# Altium schematic sheet RS-485.SchDoc: RS-485
size A3; Engineer: M.GUENI; Revision: R0; SheetNumber: 05; SheetTotal: 10
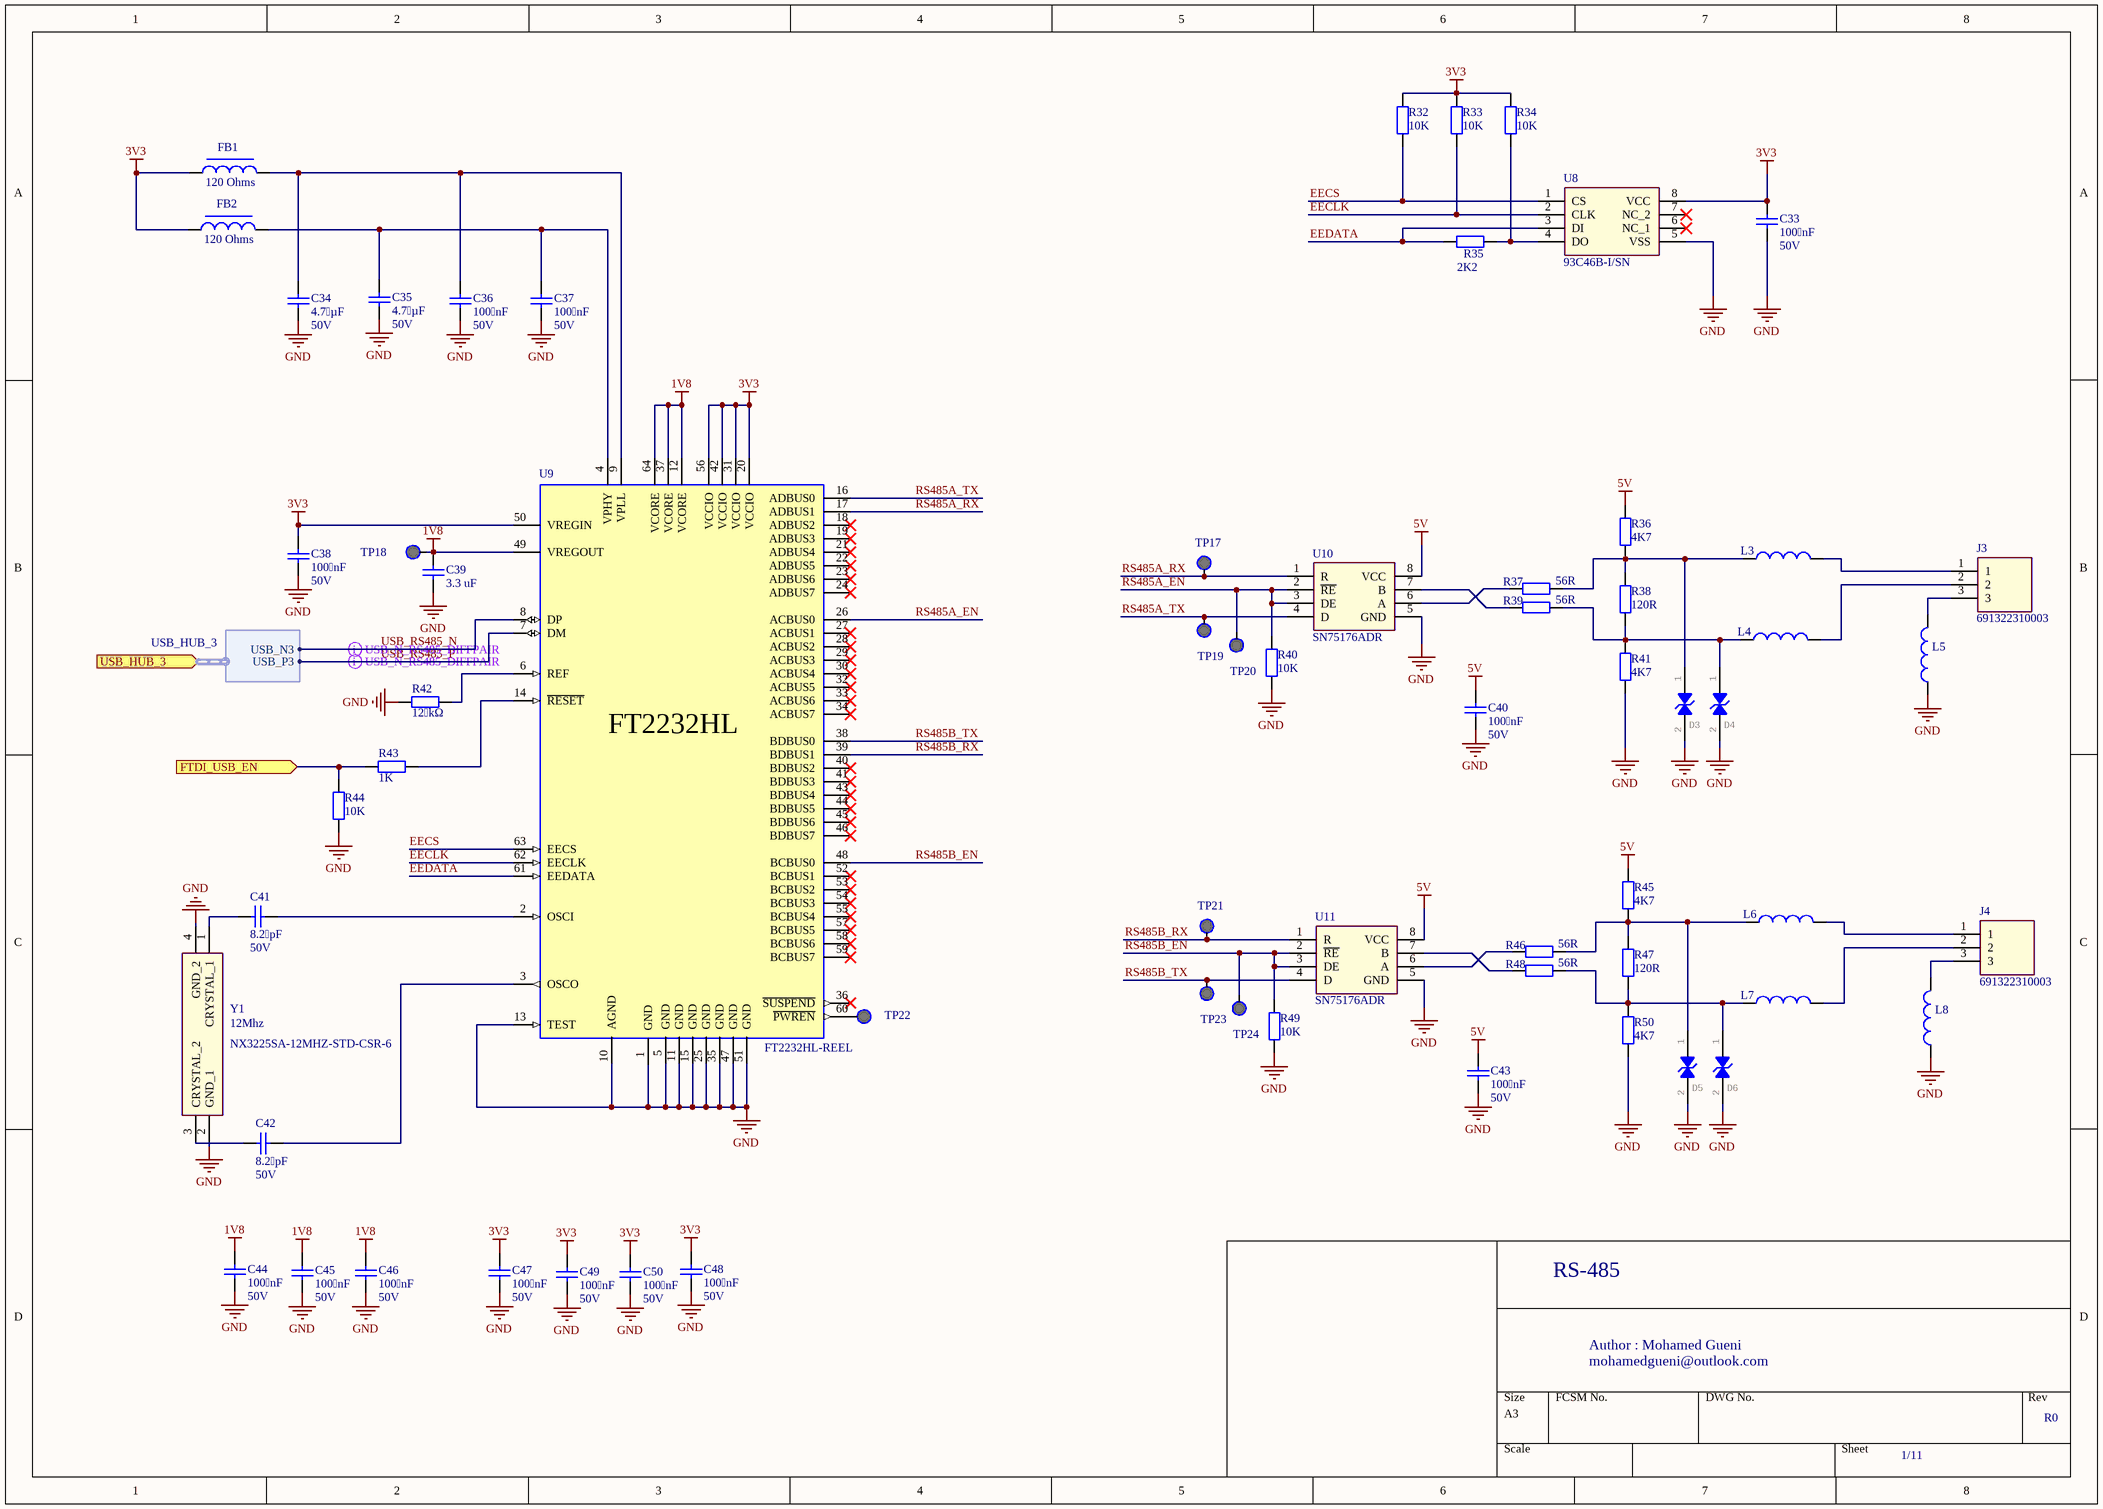
[diagram p0: RS-485.SchDoc]

## Parts
C33  Value 1: 100 nF  Value 2: 50V  [CAPC1608N]  (hidden comment: GRM188R71H104KA93D)
C34  Value 1: 4.7 µF  Value 2: 50V  [CAPC1608N]  (hidden comment: GRM188R61H475KE11D)
C35  Value 1: 4.7 µF  Value 2: 50V  [CAPC1608N]  (hidden comment: GRM188R61H475KE11D)
C36  Value 1: 100 nF  Value 2: 50V  [CAPC1608N]  (hidden comment: GRM188R71H104KA93D)
C37  Value 1: 100 nF  Value 2: 50V  [CAPC1608N]  (hidden comment: GRM188R71H104KA93D)
C38  Value 1: 100 nF  Value 2: 50V  [CAPC1608N]  (hidden comment: GRM188R71H104KA93D)
C39  Value 1: 3.3 uF  [CAPC1608N]
C40  Value 1: 100 nF  Value 2: 50V  [CAPC1608N]  (hidden comment: GRM188R71H104KA93D)
C41  Value 1: 8.2 pF  Value 2: 50V  [CAPC402]  (hidden comment: GRM1555C1H8R2CA01D)
C42  Value 1: 8.2 pF  Value 2: 50V  [CAPC402]  (hidden comment: GRM1555C1H8R2CA01D)
C43  Value 1: 100 nF  Value 2: 50V  [CAPC1608N]  (hidden comment: GRM188R71H104KA93D)
C44  Value 1: 100 nF  Value 2: 50V  [CAPC1608N]  (hidden comment: GRM188R71H104KA93D)
C45  Value 1: 100 nF  Value 2: 50V  [CAPC1608N]  (hidden comment: GRM188R71H104KA93D)
C46  Value 1: 100 nF  Value 2: 50V  [CAPC1608N]  (hidden comment: GRM188R71H104KA93D)
C47  Value 1: 100 nF  Value 2: 50V  [CAPC1608N]  (hidden comment: GRM188R71H104KA93D)
C48  Value 1: 100 nF  Value 2: 50V  [CAPC1608N]  (hidden comment: GRM188R71H104KA93D)
C49  Value 1: 100 nF  Value 2: 50V  [CAPC1608N]  (hidden comment: GRM188R71H104KA93D)
C50  Value 1: 100 nF  Value 2: 50V  [CAPC1608N]  (hidden comment: GRM188R71H104KA93D)
D3  CDSOD323-T12LC  [CDSOD323T12LC]  (value not drawn)
D4  CDSOD323-T12LC  [CDSOD323T12LC]  (value not drawn)
D5  CDSOD323-T12LC  [CDSOD323T12LC]  (value not drawn)
D6  CDSOD323-T12LC  [CDSOD323T12LC]  (value not drawn)
FB1  Value 1: 120 Ohms  [BLM18SP221SN1B]  (hidden comment: BLM18PG121SN1D)
FB2  Value 1: 120 Ohms  [BLM18SP221SN1B]  (hidden comment: BLM18PG121SN1D)
J3  691322310003  [691322310003]
J4  691322310003  [691322310003]
L3  MAF0603FAL330BT000  [BEADC0603X33N]  (value not drawn)
L4  MAF0603FAL330BT000  [BEADC0603X33N]  (value not drawn)
L5  MAF0603FAL330BT000  [BEADC0603X33N]  (value not drawn)
L6  MAF0603FAL330BT000  [BEADC0603X33N]  (value not drawn)
L7  MAF0603FAL330BT000  [BEADC0603X33N]  (value not drawn)
L8  MAF0603FAL330BT000  [BEADC0603X33N]  (value not drawn)
R32  Value 1: 10K  [RESC1608N]  (hidden comment: RN731JTTD1002F25)
R33  Value 1: 10K  [RESC1608N]  (hidden comment: RN731JTTD1002F25)
R34  Value 1: 10K  [RESC1608N]  (hidden comment: RN731JTTD1002F25)
R35  Value 1: 2K2  [RESC1608N]  (hidden comment: RN731JTTD2201F25)
R36  Value 1: 4K7  [RESC1608N]
R37  Value 1: 56R  [RESC1608N]
R38  Value 1: 120R  [RESC1608N]
R39  Value 1: 56R  [RESC1608N]
R40  Value 1: 10K  [RESC1608N]  (hidden comment: RN731JTTD1002F25)
R41  Value 1: 4K7  [RESC1608N]
R42  Value 1: 12 kΩ  [RESC1608N]  (hidden comment: ERJ-3EKF1202V)
R43  Value 1: 1K  [RESC1608N]  (hidden comment: RN731JTTD1001F25)
R44  Value 1: 10K  [RESC1608N]  (hidden comment: RN731JTTD1002F25)
R45  Value 1: 4K7  [RESC1608N]
R46  Value 1: 56R  [RESC1608N]
R47  Value 1: 120R  [RESC1608N]
R48  Value 1: 56R  [RESC1608N]
R49  Value 1: 10K  [RESC1608N]  (hidden comment: RN731JTTD1002F25)
R50  Value 1: 4K7  [RESC1608N]
TP17  Test Point  [TP]  (value not drawn)  (no BOM)
TP18  Test Point  [TP]  (value not drawn)  (no BOM)
TP19  Test Point  [TP]  (value not drawn)  (no BOM)
TP20  Test Point  [TP]  (value not drawn)  (no BOM)
TP21  Test Point  [TP]  (value not drawn)  (no BOM)
TP22  Test Point  [TP]  (value not drawn)  (no BOM)
TP23  Test Point  [TP]  (value not drawn)  (no BOM)
TP24  Test Point  [TP]  (value not drawn)  (no BOM)
U8  93C46B-I/SN  [SOIC127P600X175-8N]
U9  FT2232HL-REEL  [LQFP-64]
U10  SN75176ADR  [SOIC127P600X175-8N]
U11  SN75176ADR  [SOIC127P600X175-8N]
Y1  NX3225SA-12MHZ-STD-CSR-6  Value 1: 12Mhz  [NX3225SA]

## Ports
FTDI_USB_EN (in), USB_HUB_3 (in, harness USB_HUB_3)

## Harnesses
USB_HUB_3: USB_P3, USB_N3

## Nets
1V8: C39.2 C44.2 C45.2 C46.2 TP18.1 U9.12(VCORE) U9.37(VCORE) U9.49(VREGOUT) U9.64(VCORE)
3V3: C33.2 C38.2 C47.2 C48.2 C49.2 C50.2 FB1.1 FB2.1 R32.2 R33.2 R34.2 U8.8(VCC) U9.20(VCCIO) U9.31(VCCIO) U9.42(VCCIO) U9.50(VREGIN) U9.56(VCCIO)
5V: C40.2 C43.2 R36.2 R45.2 U10.8(VCC) U11.8(VCC)
GND: C33.1 C34.1 C35.1 C36.1 C37.1 C38.1 C39.1 C40.1 C43.1 C44.1 C45.1 C46.1 C47.1 C48.1 C49.1 C50.1 D3.2 D4.2 D5.2 D6.2 L5.1 L8.1 R40.1 R41.1 R42.1 R44.1 R49.1 R50.1 U8.5(VSS) U9.1(GND) U9.5(GND) U9.10(AGND) U9.11(GND) U9.13(TEST) U9.15(GND) U9.25(GND) U9.35(GND) U9.47(GND) U9.51(GND) U10.5(GND) U11.5(GND) Y1.2(GND_1) Y1.4(GND_2)
EECLK: R33.1 U8.2(CLK) U9.62(EECLK)
EECS: R32.1 U8.1(CS) U9.63(EECS)
EEDATA: R35.1 U8.3(DI) U9.61(EEDATA)
FTDI_USB_EN: R43.1 R44.2 ; port FTDI_USB_EN
RS485A_EN: R40.2 TP20.1 U9.26(ACBUS0) U10.2(~{RE}) U10.3(DE)
RS485A_RX: TP17.1 U9.17(ADBUS1) U10.1(R)
RS485A_TX: TP19.1 U9.16(ADBUS0) U10.4(D)
RS485B_EN: R49.2 TP24.1 U9.48(BCBUS0) U11.2(~{RE}) U11.3(DE)
RS485B_RX: TP21.1 U9.39(BDBUS1) U11.1(R)
RS485B_TX: TP23.1 U9.38(BDBUS0) U11.4(D)
USB_RS485_N: U9.8(DP) ; port USB_HUB_3.USB_N3
USB_RS485_P: U9.7(DM) ; port USB_HUB_3.USB_P3
NetC34_2: C34.2 C36.2 FB1.2 U9.9(VPLL)
NetC35_2: C35.2 C37.2 FB2.2 U9.4(VPHY)
NetC41_1: C41.1 U9.2(OSCI)
NetC41_2: C41.2 Y1.1(CRYSTAL_1)
NetC42_1: C42.1 U9.3(OSCO)
NetC42_2: C42.2 Y1.3(CRYSTAL_2)
NetD3_1: D3.1 L3.1 R36.1 R37.2 R38.2
NetD4_1: D4.1 L4.1 R38.1 R39.2 R41.2
NetD5_1: D5.1 L6.1 R45.1 R46.2 R47.2
NetD6_1: D6.1 L7.1 R47.1 R48.2 R50.2
NetJ3_1: J3.1 L3.2
NetJ3_2: J3.2 L4.2
NetJ3_3: J3.3 L5.2
NetJ4_1: J4.1 L6.2
NetJ4_2: J4.2 L7.2
NetJ4_3: J4.3 L8.2
NetR34_1: R34.1 R35.2 U8.4(DO)
NetR37_1: R37.1 U10.6(A)
NetR39_1: R39.1 U10.7(B)
NetR42_2: R42.2 U9.6(REF)
NetR43_2: R43.2 U9.14(~{RESET})
NetR46_1: R46.1 U11.6(A)
NetR48_1: R48.1 U11.7(B)
NetTP22_1: TP22.1 U9.60(~{PWREN})

Not connected (* = marked no-connect by the designer): U8 6(NC_1)* 7(NC_2)*; U9 18(ADBUS2)* 19(ADBUS3)* 21(ADBUS4)* 22(ADBUS5)* 23(ADBUS6)* 24(ADBUS7)* 27(ACBUS1)* 28(ACBUS2)* 29(ACBUS3)* 30(ACBUS4)* 32(ACBUS5)* 33(ACBUS6)* 34(ACBUS7)* 36(~{SUSPEND})* 40(BDBUS2)* 41(BDBUS3)* 43(BDBUS4)* 44(BDBUS5)* 45(BDBUS6)* 46(BDBUS7)* 52(BCBUS1)* 53(BCBUS2)* 54(BCBUS3)* 55(BCBUS4)* 57(BCBUS5)* 58(BCBUS6)* 59(BCBUS7)*

## Layout directives
differential pair; differential pair class USB_N_RS485_DIFFPAIR: USB_RS485_N, USB_RS485_P

## Notes on the sheet
- RS-485
- Author : Mohamed Gueni
- mohamedgueni@outlook.com
- 1/11
- R0
- Title:
- Micro Device Tunisie
- Size:
- Date:
- File:
- A3
- Engineer :
- Revision:
- Sheet
- of
- Cyber Parc  Hammam Sousse
- Avenue Charles De Gaulle
- 4011, Hammam-Sousse, Tunisie
- contact@mdtunisie.com
- (in symbol GIC-000000005) FT2232HL

## Library data of the parts
C33 C36-C38 C40 C43-C50 = CAP-000000017: MAN: Murata; DES: Ceramic Capacitor, 100 nF, 50V, X7R, 0603; FTP: 603; SUPREF: 81-GRM188R71H104KA93D; Part Number: CAP-000000017; MANREF: GRM188R71H104KA93D
C34 C35 = CAP-000000021: MAN: Murata; DES: Ceramic Capacitor, 4.7 µF, 50V, X5R, 0603; FTP: 603; SUPREF: 81-GRM188R61H475KE11D; Part Number: CAP-000000021; MANREF: GRM188R61H475KE11D
C39 = CAP-000000008: FTP: 0603; Part Number: CAP-000000008
C41 C42 = CAP-000000013: MAN: Murata; DES: Ceramic Capacitor, 8.2 pF, 50V, C0G, 0402; FTP: 402; SUPREF: 81-GRM1555C1H8R2CA01D; Part Number: CAP-000000013; MANREF: GRM1555C1H8R2CA01D
D3-D6 = TVS-000000003: MAN: Bourns; DES: ESD Protection Diodes / TVS Diodes Bidirectional Ultra Low Cap; Value 1: 12 V; Value 2: 11 A; TOL: _; FTP: SOD-323-2; SUP: Mouser; SUPREF: 652-CDSOD323-T12LC; Part Number: TVS-000000003; MANREF: CDSOD323-T12LC; NOTE: _
FB1 FB2 = F-000000001: MAN: Murata Electronics; DES: Ferrite Beads 120 OHM 25% Alternate Sizing Guide Below; Value 2: 2 A; TOL: 25 %; FTP: F0603; SUP: Mouser; SUPREF: 81-BLM18PG121SN1D; NOTE: _; Part Number: F-000000001; MANREF: BLM18PG121SN1D
J3 J4 = CON-000000011: MAN: Wurth Elektronik; DES: Pluggable Terminal Blocks WR-TBL 300VAC 10A 3P Right Angle; Value 1: _; FTP: THT; SUP: Mouser; SUPREF: 710-691322310003; Part Number: CON-000000011; MANREF: 691322310003; Value 2: _; TOL: _; NOTE: _
L3-L8 = IND-000000006: MAN: TDK; DES: Common Mode Chokes / Filters 0603 33ohm 200mA; SUP: Mouser; SUPREF: 810-MAF0603FAL330BT0; Part Number: IND-000000006; MANREF: MAF0603FAL330BT000
R32-R34 R40 R44 R49 = RES-000000007: MAN: KOA Speer; DES: Thin Film Resistors - SMD 10kOhm,0603,1%,25ppm ,63mW,50V; Value 2: 0.63W; TOL: 1%; FTP: 0603; SUP: Mouser; SUPREF: 660-RN731JTTD1002F25; NOTE: _; Part Number: RES-000000007; MANREF: RN731JTTD1002F25
R35 = RES-000000006: MAN: KOA Speer; DES: Thin Film Resistors - SMD 2.2kOhm,0603,1%,25pp m,63mW,50V; Value 2: 0.1W; TOL: 1%; FTP: 0603; SUP: Mouser; SUPREF: 660-RN731JTTD2201F25; NOTE: _; Part Number: RES-000000006; MANREF: RN731JTTD2201F25
R36 R41 R45 R50 = RES-000000010: FTP: 0603; SUP: Mouser; NOTE: _; Part Number: RES-000000010
R37 R39 R46 R48 = RES-000000012: FTP: 0603; SUP: Mouser; NOTE: _; Part Number: RES-000000012
R38 R47 = RES-000000013: FTP: 0603; SUP: Mouser; NOTE: _; Part Number: RES-000000013
R42 = RES-0000000011: MAN: Panasonic; DES: Thick Film Resistor, 12 kΩ, 1%, 200 mW, 0603; TOL: 1%; FTP: 0603; SUP: Mouser; SUPREF: 667-ERJ-3EKF1202V; NOTE: _; Part Number: RES-0000000011; MANREF: ERJ-3EKF1202V
R43 = RES-000000001: MAN: KOA Speer; DES: Thin Film Resistors - SMD 1kOhm,0603,1%,25ppm, 63mW,50V; Value 2: 0.63W; TOL: 1%; FTP: 0603; SUP: Mouser; SUPREF: 660-RN731JTTD1001F25; NOTE: _; Part Number: RES-000000001; MANREF: RN731JTTD1001F25
TP17-TP24 = MIS-000000002: MAN: _; Part Number: MIS-000000002; MANREF: _; DES: _; Value 1: _; Value 2: _; TOL: _; FTP: _; SUP: _; SUPREF: _; NOTE: _
U8 = GIC-000000012: MAN: Microchip Technology; DES: EEPROM 64x16; Value 1: _; FTP: SOIC-8; SUP: Mouser; SUPREF: 579-93C46B-I/SN; Part Number: GIC-000000012; MANREF: 93C46B-I/SN; Value 2: _; TOL: _; NOTE: _
U9 = GIC-000000005: MAN: FTDI; DES: USB Interface IC USB HS to Dual UART/ FIFO/SPI/JTAG/I2C; Value 1: 3.3 V; Value 2: 70 mA; TOL: _; SUP: Mouser; SUPREF: 895-FT2232HL; Part Number: GIC-000000005; MANREF: FT2232HL-REEL; FTP: LQFP-64; NOTE: _
U10 U11 = GIC-000000013: MAN: Texas Instruments; DES: RS-422/RS-485 Interface IC Differential Bus Tra ns A 595-SN75176AD; TOL: _; FTP: SOIC-8; SUP: Mouser; SUPREF: 595-SN75176ADR; Part Number: GIC-000000013; MANREF: SN75176ADR; NOTE: _
Y1 = Y-000000002: MAN: NDK; DES: Crystals CRYSTAL 12MHZ 8PF SMD; FTP: _; SUP: Mouser; SUPREF: 344-NX3225SA12MCSR6; Part Number: Y-000000002; MANREF: NX3225SA-12MHZ-STD-CSR-6; NOTE: _